# EAGLE design sensor-dht-volt-generic (EAGLE 9.1.1)

## Sheet 1 of 2
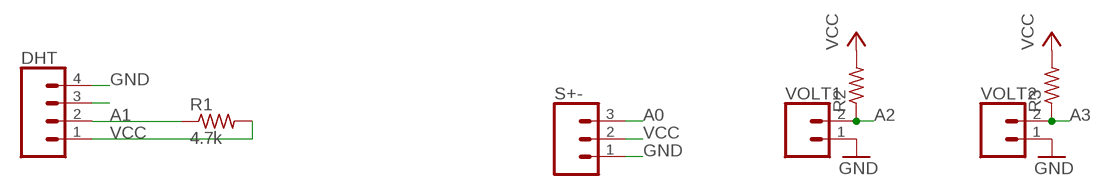
[diagram p0: schematic, sheet 1]

### Parts
DHT  CONN_04  [1X04]
R1  4.7k  R-US_R0603  [R0603]
R2  R-US_R0603  [R0603]
R3  R-US_R0603  [R0603]
S+-  CONN_03  [1X03]
VOLT1  CONN_02  [1X02]
VOLT2  CONN_02  [1X02]

### Nets
A0: S+-.3 ; also sheet 2
A1: DHT.2 R1.1 ; also sheet 2
A2: R2.1 VOLT1.2 ; also sheet 2
A3: R3.1 VOLT2.2 ; also sheet 2
GND: DHT.4 S+-.1 VOLT1.1 VOLT2.1 ; also sheet 2
N$6: DHT.3
VCC: DHT.1 R1.2 R2.2 R3.2 S+-.2 ; also sheet 2

## Sheet 2 of 2
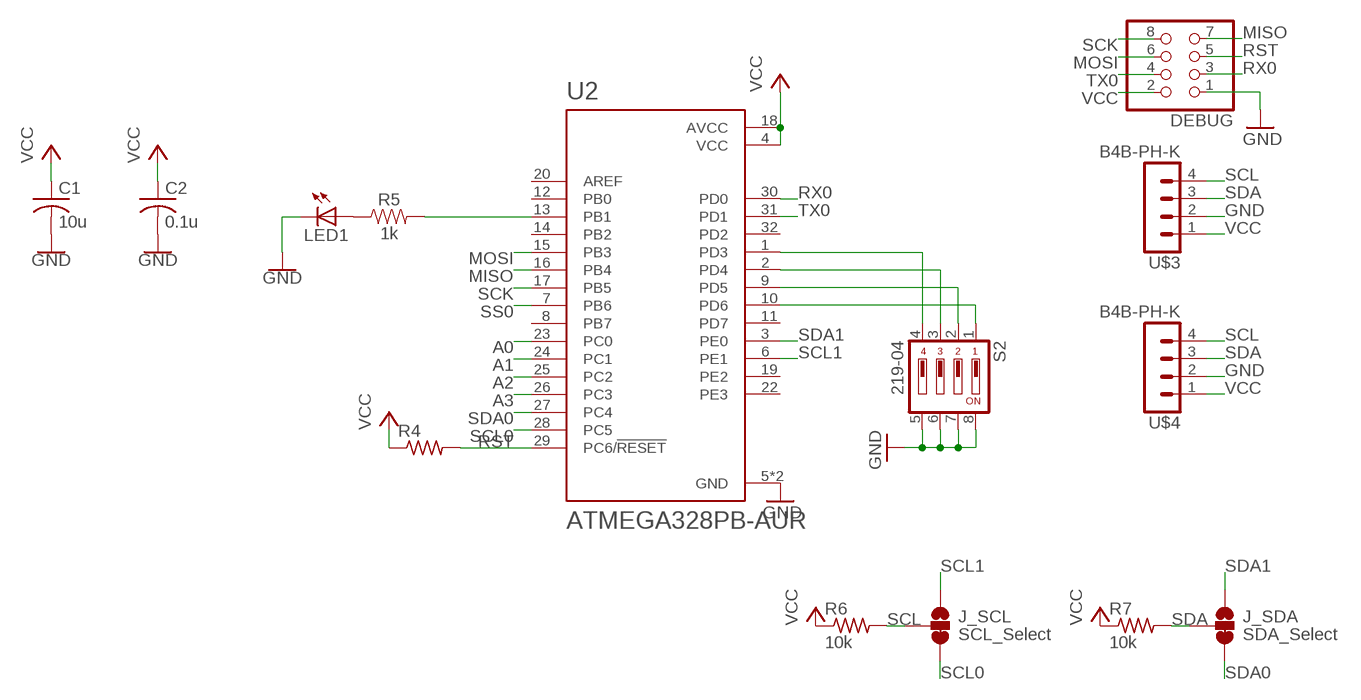
[diagram p1: schematic, sheet 2]

### Parts
C1  10u  C-USC0603  [C0603]
C2  0.1u  C-USC0603  [C0603]
DEBUG  PINHD-2X4  [2X04]
J_SCL  SCL_Select  JUMPER-SMT_3_1-NC_TRACE_SILK  [SMT-JUMPER_3_1-NC_TRACE_SILK]
J_SDA  SDA_Select  JUMPER-SMT_3_1-NC_TRACE_SILK  [SMT-JUMPER_3_1-NC_TRACE_SILK]
LED1  LEDSML0805  [SML0805]
R4  R-US_R0603  [R0603]
R5  1k  1KOHM-0603-1/10W-1%  [0603]
R6  10k  R-US_R0603  [R0603]
R7  10k  R-US_R0603  [R0603]
S2  219-04  [CTS-219-04]
U2  ATMEGA328PB-AUR  [QFP80P900X900X120-32N]
U$3  B4B-PH-K  [B4B-PH-K]
U$4  B4B-PH-K  [B4B-PH-K]

### Nets
A0: U2.23(PC0) ; also sheet 1
A1: U2.24(PC1) ; also sheet 1
A2: U2.25(PC2) ; also sheet 1
A3: U2.26(PC3) ; also sheet 1
GND: C1.2 C2.2 DEBUG.1 LED1.C S2.5 S2.6 S2.7 S2.8 U2.5(GND) U2.21(GND) U$3.2 U$4.2 ; also sheet 1
MISO: DEBUG.7 U2.16(PB4)
MOSI: DEBUG.6 U2.15(PB3)
N$1: S2.4 U2.1(PD3)
N$2: S2.3 U2.2(PD4)
N$3: S2.2 U2.9(PD5)
N$4: S2.1 U2.10(PD6)
N$12: LED1.A R5.1
N$13: R5.2 U2.13(PB1)
RST: DEBUG.5 R4.2 U2.29(PC6/!RESET)
RX0: DEBUG.3 U2.30(PD0)
SCK: DEBUG.8 U2.17(PB5)
SCL: J_SCL.2 R6.2 U$3.4 U$4.4
SCL0: J_SCL.3 U2.28(PC5)
SCL1: J_SCL.1 U2.6(PE1)
SDA: J_SDA.2 R7.2 U$3.3 U$4.3
SDA0: J_SDA.3 U2.27(PC4)
SDA1: J_SDA.1 U2.3(PE0)
SS0: U2.7(PB6)
TX0: DEBUG.4 U2.31(PD1)
VCC: C1.1 C2.1 DEBUG.2 R4.1 R6.1 R7.1 U2.4(VCC) U2.18(AVCC) U$3.1 U$4.1 ; also sheet 1
Unconnected: U2.8(PB7) U2.11(PD7) U2.12(PB0) U2.14(PB2) U2.19(PE2) U2.20(AREF) U2.22(PE3) U2.32(PD2)

## Library data of the parts
C1 C2 = resistor:C-US: CAPACITOR, American symbol
DEBUG = pinhead:PINHD-2X4: PIN HEADER
DHT = SparkFun-Connectors:CONN_04: Multi connection point. Often used as Generic Header-pin footprint for 0.1 inch spaced/style header connections On any of the 0.1 inch spaced packages, you can populate with these: Break Away Headers - Straight <https://www.sparkfun.com/products/116> (PRT-00116) Break Away Male Headers - Right Angle <https://www.sparkfun.com/products/553> (PRT-00553) Female Headers <https://www.sparkfun.com/products/115> (PRT-00115) Break Away Headers - Machine Pin <https://www.sparkfun.com/products/117> (PRT-00117) Break Away Female Headers - Swiss Machine Pin <https://www.sparkfun.com/products/743> (PRT-00743) For SCREWTERMINALS and SPRING TERMINALS visit here: Screw Terimnals on SparkFun.com <https://www.sparkfun.com/search/results?term=Screw+Terminals> (5mm/3.5mm/2.54mm spacing) This device is also useful as a general connection point to wire up your design to another part of your project. Our various solder wires solder well into these plated through hole pads. Hook-Up Wire - Assortment (Stranded, 22 AWG) <https://www.sparkfun.com/products/11375> (PRT-11375) Hook-Up Wire - Assortment (Solid Core, 22 AWG) <https://www.sparkfun.com/products/11367> (PRT-11367) View the entire wire category on our website here <https://www.sparkfun.com/categories/141> Special notes: Molex polarized connector foot print use with SKU : PRT-08231 with associated crimp pins and housings. 1MM SMD Version SKU: PRT-10208; PROD_ID: CONN-09696
J_SCL J_SDA = SparkFun-Jumpers:JUMPER-SMT_3_1-NC_TRACE: Normally closed trace jumper (1 of 2 connections) This jumper has a trace between two pads so it's normally closed (NC). The other connection is normally open (NO). Use a razor knife to open the connection. For best results follow the IPC guidelines for cutting traces: Cutout at least 0.063 mm (0.005 in). Remove all loose material to clean up the cut area. Seal the cut with an approved epoxy. Reapply solder to reclose the connection, or to close the NO connection.
LED1 = led:LED: LED OSRAM: - CHIPLED LG R971, LG N971, LY N971, LG Q971, LY Q971, LO R971, LY R971 LH N974, LH R974 LS Q976, LO Q976, LY Q976 LO Q996 - Hyper CHIPLED LW Q18S LB Q993, LB Q99A, LB R99A - SideLED LS A670, LO A670, LY A670, LG A670, LP A670 LB A673, LV A673, LT A673, LW A673 LH A674 LY A675 LS A676, LA A676, LO A676, LY A676, LW A676 LS A679, LY A679, LG A679 - Hyper Micro SIDELED® LS Y876, LA Y876, LO Y876, LY Y876 LT Y87S - SmartLED LW L88C, LW L88S LB L89C, LB L89S, LG L890 LS L89K, LO L89K, LY L89K LS L896, LA L896, LO L896, LY L896 - TOPLED LS T670, LO T670, LY T670, LG T670, LP T670 LSG T670, LSP T670, LSY T670, LOP T670, LYG T670 LG T671, LOG T671, LSG T671 LB T673, LV T673, LT T673, LW T673 LH T674 LS T676, LA T676, LO T676, LY T676, LB T676, LH T676, LSB T676, LW T676 LB T67C, LV T67C, LT T67C, LS T67K, LO T67K, LY T67K, LW E67C LS E67B, LA E67B, LO E67B, LY E67B, LB E67C, LV E67C, LT E67C LW T67C LS T679, LY T679, LG T679 LS T770, LO T770, LY T770, LG T770, LP T770 LB T773, LV T773, LT T773, LW T773 LH T774 LS E675, LA E675, LY E675, LS T675 LS T776, LA T776, LO T776, LY T776, LB T776 LHGB T686 LT T68C, LB T68C - Hyper Mini TOPLED® LB M676 - Mini TOPLED Santana® LG M470 LS M47K, LO M47K, LY M47K Source: http://www.osram.convergy.de LUXEON: - LUMILED® LXK2-PW12-R00, LXK2-PW12-S00, LXK2-PW14-U00, LXK2-PW14-V00 LXK2-PM12-R00, LXK2-PM12-S00, LXK2-PM14-U00 LXK2-PE12-Q00, LXK2-PE12-R00, LXK2-PE12-S00, LXK2-PE14-T00, LXK2-PE14-U00 LXK2-PB12-K00, LXK2-PB12-L00, LXK2-PB12-M00, LXK2-PB14-N00, LXK2-PB14-P00, LXK2-PB14-Q00 LXK2-PR12-L00, LXK2-PR12-M00, LXK2-PR14-Q00, LXK2-PR14-R00 LXK2-PD12-Q00, LXK2-PD12-R00, LXK2-PD12-S00 LXK2-PH12-R00, LXK2-PH12-S00 LXK2-PL12-P00, LXK2-PL12-Q00, LXK2-PL12-R00 Source: www.luxeon.com KINGBRIGHT: KA-3528ASYC Source: www.kingbright.com
R1-R4 R6 R7 = resistor:R-US_: RESISTOR, American symbol
R5 = SparkFun-Resistors:1KOHM: 1kΩ resistor A resistor is a passive two-terminal electrical component that implements electrical resistance as a circuit element. Resistors act to reduce current flow, and, at the same time, act to lower voltage levels within circuits. - Wikipedia; PROD_ID: RES-07856
S2 = switch-dil:219-04*: Surface Mount DIP Switch Series 219 SMT CTS Electronic Components Sourc: www.ctscorp.com; OC_FARNELL: unknown; OC_NEWARK: unknown
S+- = SparkFun-Connectors:CONN_03: Multi connection point. Often used as Generic Header-pin footprint for 0.1 inch spaced/style header connections On any of the 0.1 inch spaced packages, you can populate with these: Break Away Headers - Straight <https://www.sparkfun.com/products/116> (PRT-00116) Break Away Male Headers - Right Angle <https://www.sparkfun.com/products/553> (PRT-00553) Female Headers <https://www.sparkfun.com/products/115> (PRT-00115) Break Away Headers - Machine Pin <https://www.sparkfun.com/products/117> (PRT-00117) Break Away Female Headers - Swiss Machine Pin <https://www.sparkfun.com/products/743> (PRT-00743) Stackable Header - 3 Pin (Female, 0.1") <https://www.sparkfun.com/products/13875> (PRT-13875) For SCREWTERMINALS and SPRING TERMINALS visit here: Screw Terimnals on SparkFun.com <https://www.sparkfun.com/search/results?term=Screw+Terminals> (5mm/3.5mm/2.54mm spacing) This device is also useful as a general connection point to wire up your design to another part of your project. Our various solder wires solder well into these plated through hole pads. Hook-Up Wire - Assortment (Stranded, 22 AWG) <https://www.sparkfun.com/products/11375> (PRT-11375) Hook-Up Wire - Assortment (Solid Core, 22 AWG) <https://www.sparkfun.com/products/11367> (PRT-11367) View the entire wire category on our website here <https://www.sparkfun.com/categories/141> Special notes: Molex polarized connector foot print use with SKU : PRT-08232 with associated crimp pins and housings.; PROD_ID: XXX-00000; VALUE: 455-1750-1-ND
U2 = ATMEGA328PB-AUR:ATMEGA328PB-AUR: ATmega Series 20 MHz 32 KB Flash 2 KB SRAM 8-Bit Microcontroller - TQFP-32; DESCRIPTION: AVR microcontroller; EEPROM: 1024B; SRAM: 2kB; Flash: 32kB; TQFP32; DIGI-KEY_PART_NUMBER: ATMEGA328PB-AURCT-ND; DIGI-KEY_PURCHASE_URL: https://www.digikey.com/product-detail/en/microchip-technology/ATMEGA328PB-AUR/ATMEGA328PB-AURCT-ND/5722706?WT.z_cid=ref_snapeda&utm_source=snapeda&utm_medium=aggregator&utm_campaign=buynow; MF: Microchip; MP: ATMEGA328PB-AUR; PACKAGE: TQFP-32 Microchip
U$3 U$4 = con-jst-ph:B4B-PH-K: HEADER
VOLT1 VOLT2 = SparkFun-Connectors:CONN_02: Multi connection point. Often used as Generic Header-pin footprint for 0.1 inch spaced/style header connections On any of the 0.1 inch spaced packages, you can populate with these: Break Away Headers - Straight <https://www.sparkfun.com/products/116> (PRT-00116) Break Away Male Headers - Right Angle <https://www.sparkfun.com/products/553> (PRT-00553) Female Headers <https://www.sparkfun.com/products/115> (PRT-00115) Break Away Headers - Machine Pin <https://www.sparkfun.com/products/117> (PRT-00117) Break Away Female Headers - Swiss Machine Pin <https://www.sparkfun.com/products/743> (PRT-00743) For SCREWTERMINALS and SPRING TERMINALS visit here: Screw Terimnals on SparkFun.com <https://www.sparkfun.com/search/results?term=Screw+Terminals> (5mm/3.5mm/2.54mm spacing) This device is also useful as a general connection point to wire up your design to another part of your project. Our various solder wires solder well into these plated through hole pads. Hook-Up Wire - Assortment (Stranded, 22 AWG) <https://www.sparkfun.com/products/11375> (PRT-11375) Hook-Up Wire - Assortment (Solid Core, 22 AWG) <https://www.sparkfun.com/products/11367> (PRT-11367) View the entire wire category on our website here <https://www.sparkfun.com/categories/141> Special notes: Molex polarized connector foot print use with: PRT-08233 with associated crimp pins and housings. 2.54_SCREWTERM for use with PRT-10571. 3.5mm Screw Terminal footprints for PRT-08084 5mm Screw Terminal footprints for use with PRT-08432

## Module 2
Ports: 

### Library data of the parts

## Board
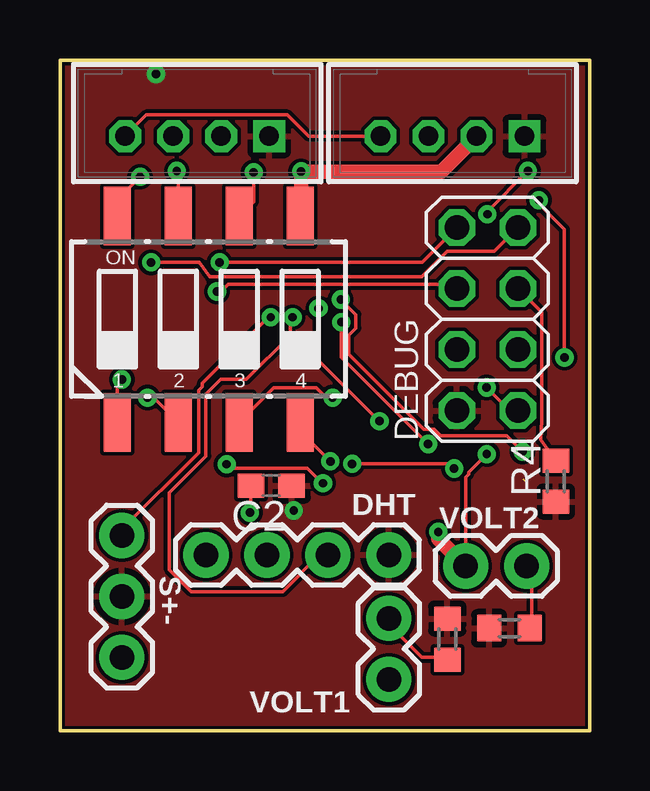
[diagram p2: board, top side]
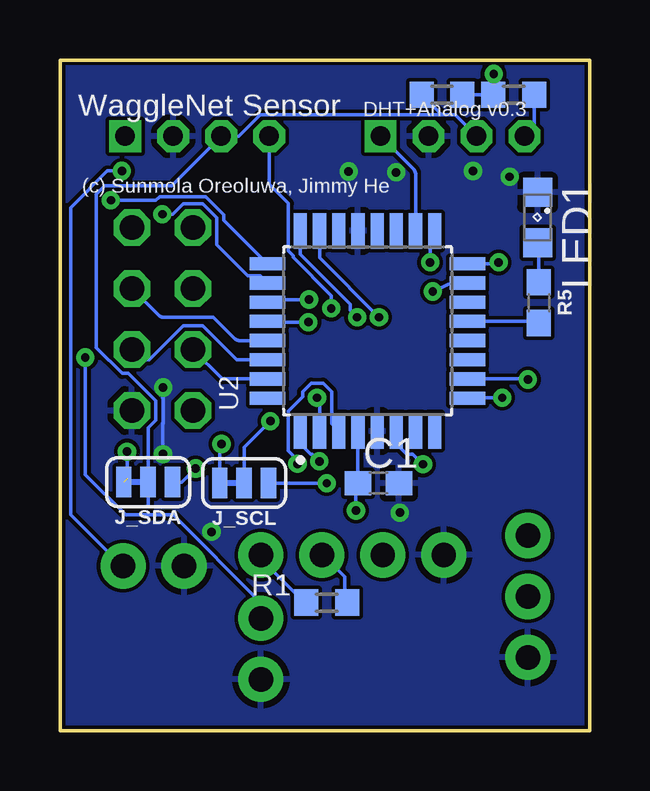
[diagram p3: board, bottom side, seen from below]

Size 22.07 x 27.94 mm. Coordinates in mm from the lower left corner, seen from the top.
Outline: 0,0 0,27.94 22.07,27.94 22.07,0 0,0
Copper layers (1*16): Top 0.035mm / dielectric 1.5mm / Bottom 0.035mm
Design rules "default *": minimum track width 6mil, minimum drill 0.35mm, track to track 6mil, track to pad 6mil, pad to pad 6mil, via to via 6mil, smd to smd 6mil, copper to edge 5mil, drill to drill 6mil, minimum pad ring 10mil, minimum via ring 8mil, stop-mask expansion 4mil, vias tented up to drill 20mil, thermal gap 10mil

### Footprints (pad centres in the part's own frame; a part is rotated, then mirrored left to right if it is on the bottom)
C0603 = smd 1.1 x 1: 1 -0.85,0; 2 0.85,0
2X04 = drill 1.016 octagon: 1 -3.81,-1.27; 2 -3.81,1.27; 3 -1.27,-1.27; 4 -1.27,1.27; 5 1.27,-1.27; 6 1.27,1.27; 7 3.81,-1.27; 8 3.81,1.27
1X04 = drill 1.016 pad 1.88: 1 0,0; 2 2.54,0; 3 5.08,0; 4 7.62,0
SMT-JUMPER_3_1-NC_TRACE_SILK = smd 0.635 x 1.27: 1 -1.016,0; 2 0,0; 3 1.016,0
SML0805 = smd 1.2 x 1.2: A 1.05,0; C -1.05,0
R0603 = smd 1 x 1.1: 1 -0.85,0; 2 0.85,0
0603 = smd 1.1 x 1: 1 -0.85,0; 2 0.85,0
CTS-219-04 = smd 1.13 x 2.44: 1 -3.81,-4.3; 2 -1.27,-4.3; 3 1.27,-4.3; 4 3.81,-4.3; 5 3.81,4.3; 6 1.27,4.3; 7 -1.27,4.3; 8 -3.81,4.3
1X03 = drill 1.016 pad 1.88: 1 0,0; 2 2.54,0; 3 5.08,0
QFP80P900X900X120-32N = smd 1.47 x 0.55: 1 -4.17,2.8; 2 -4.17,2; 3 -4.17,1.2; 4 -4.17,0.4; 5 -4.17,-0.4; 6 -4.17,-1.2; 7 -4.17,-2; 8 -4.17,-2.8; 17 4.17,-2.8; 18 4.17,-2; 19 4.17,-1.2; 20 4.17,-0.4; 21 4.17,0.4; 22 4.17,1.2; 23 4.17,2; 24 4.17,2.8 | smd 0.55 x 1.47: 9 -2.8,-4.17; 10 -2,-4.17; 11 -1.2,-4.17; 12 -0.4,-4.17; 13 0.4,-4.17; 14 1.2,-4.17; 15 2,-4.17; 16 2.8,-4.17; 25 2.8,4.17; 26 2,4.17; 27 1.2,4.17; 28 0.4,4.17; 29 -0.4,4.17; 30 -1.2,4.17; 31 -2,4.17; 32 -2.8,4.17
B4B-PH-K = drill 0.813 square: 1 -3,0 | drill 0.813 octagon: 2 -1,0; 3 1,0; 4 3,0
1X02 = drill 1.016 pad 1.88: 1 0,0; 2 2.54,0

### Placement (x,y rotation side)
C1  8.8,10.3 0 bottom
C2  8.8,10.21 180 top
DEBUG  17.81,17.14 90 top
DHT  13.7,7.32 180 top
J_SCL  14.4,10.31 180 bottom
J_SDA  18.4,10.35 180 bottom
LED1  2.17,21.37 270 bottom
R1  10.96,5.33 180 bottom
R2  16.14,3.81 90 top
R3  18.73,4.27 180 top
R4  20.66,10.39 90 top
R5  2.12,17.83 270 bottom
R6  3.16,26.49 0 bottom
R7  6.16,26.49 180 bottom
S2  6.2,17.14 0 top
S+-  2.58,3.05 90 top
U2  9.26,16.65 90 bottom
U$3  16.36,24.77 180 top
U$4  5.71,24.77 180 top
VOLT1  13.7,2.13 90 top
VOLT2  16.9,6.86 0 top

### Tracks (layer width: path | path; a pad name or v marks a point on that pad's centre or on a via)
A0  (via drill 0.35)
  Top 0.152: S+-.3 2.58,8.38 5.78,11.58 5.78,14.17 5.93,14.33 5.93,14.48 8.67,17.22 v8.78,17.22
  Bottom 0.152: U2.23 11.26,19.7 v8.78,17.22
A1  (via drill 0.35)
  Top 0.152: DHT.2 10.81,7.32 9.28,5.79 5.47,5.79 4.56,6.71 4.56,9.91 6.08,11.43 6.08,14.02 6.69,14.63 7.76,14.63 9.59,16.46 9.59,17.22 v9.69,17.22
  Bottom 0.152: v9.69,17.22 9.99,17.52 9.99,17.77 12.06,19.84 U2.24 | R1.1 10.2,5.33 10.2,6.4 11.11,7.32 DHT.2
A2  (via drill 0.35)
  Top 0.152: VOLT1.2 13.7,4.42 15.08,3.05 16.14,3.05 R2.1 | v21.02,15.54 21.02,20.88 19.95,21.95 v19.95,22.1
  Bottom 0.152: U2.25 15.24,21.26 15.24,21.49 16,22.25 17.93,22.25 18.08,22.1 v19.95,22.1 | VOLT1.2 13.7,5.33 17.36,8.99 19.34,8.99 21.02,10.67 v21.02,15.54
A3  (via drill 0.35)
  Top 0.152: R3.1 19.65,4.27 19.65,6.71 19.49,6.86 VOLT2.2 | v19.49,23.32 17.82,21.64 v17.81,21.51
  Bottom 0.152: U2.26 13.72,18.95 14.26,18.95 15.54,20.23 15.54,21.37 16.13,21.95 16.95,21.95 17.38,21.51 v17.81,21.51 | v19.49,23.32 20.1,23.32 21.63,21.79 21.63,8.99 19.49,6.86 VOLT2.2
GND  (via drill 0.35)
  Top 0.152: S2.5 10.05,21.48 | S2.6 8.07,22.04 v8.07,23.26 | S2.7 4.93,23.25 v4.86,23.32 | S2.8 2.39,22.12 v3.34,23.08 | C2.2 7.95,9.12 v7.91,9.08 | VOLT2.1 16.9,10.55 17.03,10.67 17.03,10.76 v17.78,11.52 | v17.77,14.29 18.73,13.34 DEBUG.1 | 15.76,8 v15.76,8.28
  Top 0.61: 10.05,21.48 v10.05,23.29 15.88,23.29 U$3.2 | VOLT2.1 15.76,8
  Bottom 0.152: v17.77,14.29 v17.78,14.28 17.78,13.87 17.78,12.8 v17.78,11.52
  pour Bottom: 27.47,30.48 27.47,-3.81 -4.28,-3.81 -4.28,30.48
MISO  (via drill 0.35)
  Top 0.152: DEBUG.7 18.09,19.96 16.13,19.96 15.06,18.9 6.25,18.9 5.79,19.51 v3.8,19.51
  Bottom 0.152: U2.16 3.86,19.45 v3.8,19.51
MOSI  (via drill 0.35)
  Top 0.152: v6.54,18.29 6.7,18.29 7,18.6 16.35,18.6 DEBUG.6
  Bottom 0.152: U2.15 5.9,18.6 v6.54,18.29
N$1  (via drill 0.35)
  Top 0.152: v11.27,11.21 10.01,12.47 S2.4
  Bottom 0.152: v11.27,11.21 11.57,11.52 11.63,11.52 12.06,11.95 U2.1
N$2  (via drill 0.35)
  Top 0.152: v11.36,13.87 11.09,13.87 10.67,14.29 8.92,14.29 S2.3
  Bottom 0.152: U2.2 11.26,13.77 v11.36,13.87
N$3  (via drill 0.35)
  Top 0.152: S2.2 3.9,13.87 v3.65,13.87
  Bottom 0.152: v3.65,13.87 5.07,13.87 U2.9
N$4  (via drill 0.35)
  Top 0.152: v2.58,14.63 2.39,14.44 S2.1
  Bottom 0.152: U2.10 2.6,14.65 v2.58,14.63
N$12
  Bottom 0.152: R5.1 2.12,20.27 LED1.A
N$13
  Bottom 0.152: U2.13 2.19,17.05 R5.2
RST
  Top 0.152: R4.2 20.03,12.11 20.07,12.92 20.07,17.42 DEBUG.5
  Bottom 0.152: U2.29 14.61,16.25 arc45 14.79,16.32 15.68,17.22 17.78,17.22 arc45 17.96,17.3 DEBUG.5
RX0
  Bottom 0.152: DEBUG.3 18.65,15.45 18.36,15.45 16.95,16.87 16.13,16.87 14.71,15.45 U2.30
SCK  (via drill 0.35)
  Top 0.152: v6.65,19.51 15.09,19.51 DEBUG.8
  Bottom 0.152: U2.17 6.65,20.63 v6.65,19.51
SCL  (via drill 0.35)
  Top 0.152: v13.31,12.89 10.77,15.43 v10.77,17.59 | U$3.4 10.36,24.77 9.47,25.65 3.6,25.65 U$4.4
  Bottom 0.152: J_SCL.2 14.4,11.8 v13.31,12.89 | v10.77,17.59 10.77,18.12 12.36,19.71 12.36,19.79 12.56,19.99 12.56,21.65 12.56,21.96 13.36,22.76 U$3.4 | R6.2 2.31,25.17 U$4.4
SCL0  (via drill 0.35)
  Top 0.152: v15.34,11.94 11.72,15.56 v11.72,17.02
  Bottom 0.152: J_SCL.3 15.42,11.86 v15.34,11.94 | v11.72,17.02 13.4,17.02 U2.28
SCL1  (via drill 0.35)
  Top 0.152: v10.96,10.31 10.93,10.31 10.3,10.94 7.1,10.94 v6.95,11.09
  Bottom 0.152: J_SCL.1 10.97,10.31 v10.96,10.31 | v6.95,11.09 7.37,11.52 7.63,11.52 8.06,11.95 U2.6
SDA
  Bottom 0.152: J_SDA.2 18.4,9.35 18.39,9.33 18.39,12.62 18.09,12.92 18.09,13.75 19.22,14.88 19.49,14.88 20.56,15.96 20.56,22.35 20.2,22.7 17.42,22.7 U$3.3 14.62,24.77 13.73,25.65 6.17,25.65 | U$4.3 5.6,25.65 6.17,25.65 | R7.2 6.17,25.65
SDA0  (via drill 0.35)  (1 unrouted)
  Top 0.152: v11.7,17.96 12.33,17.33 12.33,16.77 12.03,16.47 12.03,15.68 15.17,12.54 15.59,12.54 15.86,12.28 18.62,12.28 v19.28,11.62
  Bottom 0.152: 19.28,10.49 v19.28,11.62 | v11.7,17.96 13.32,17.96 U2.27
SDA1  (via drill 0.35)
  Top 0.152: v16.42,10.92 16.23,11.11 v12.17,11.11
  Bottom 0.152: J_SDA.1 16.99,10.35 v16.42,10.92 | U2.3 10.75,12.78 10.75,14.12 11.11,14.48 11.61,14.48 11.97,14.12 11.97,13.9 12.56,13.31 12.56,11.65 12.17,11.26 v12.17,11.11
TX0
  Bottom 0.152: U2.31 15.31,14.65 DEBUG.4
VCC  (via drill 0.35)
  Bottom 0.152: U2.18 7.26,23.2 arc-45 7.33,23.38 U$4.1 | U2.4 C1.1 9.74,10.21 v9.74,9.17 | DHT.1 13.7,7.16 11.87,5.33 R1.2 | R7.1 R6.1 4.01,27.35 v4,27.36
  pour Top: 30.01,31.75 30.01,-5.08 -6.82,-5.08 -6.82,31.75

### Text on the board
bNames: DHT+Analog v0.3 | WaggleNet Sensor | (c) Sunmola Oreoluwa, Jimmy He